# EAGLE design counter-defender-esp8266-attiny85-pir-mk-1.0 (EAGLE 7.5.0)
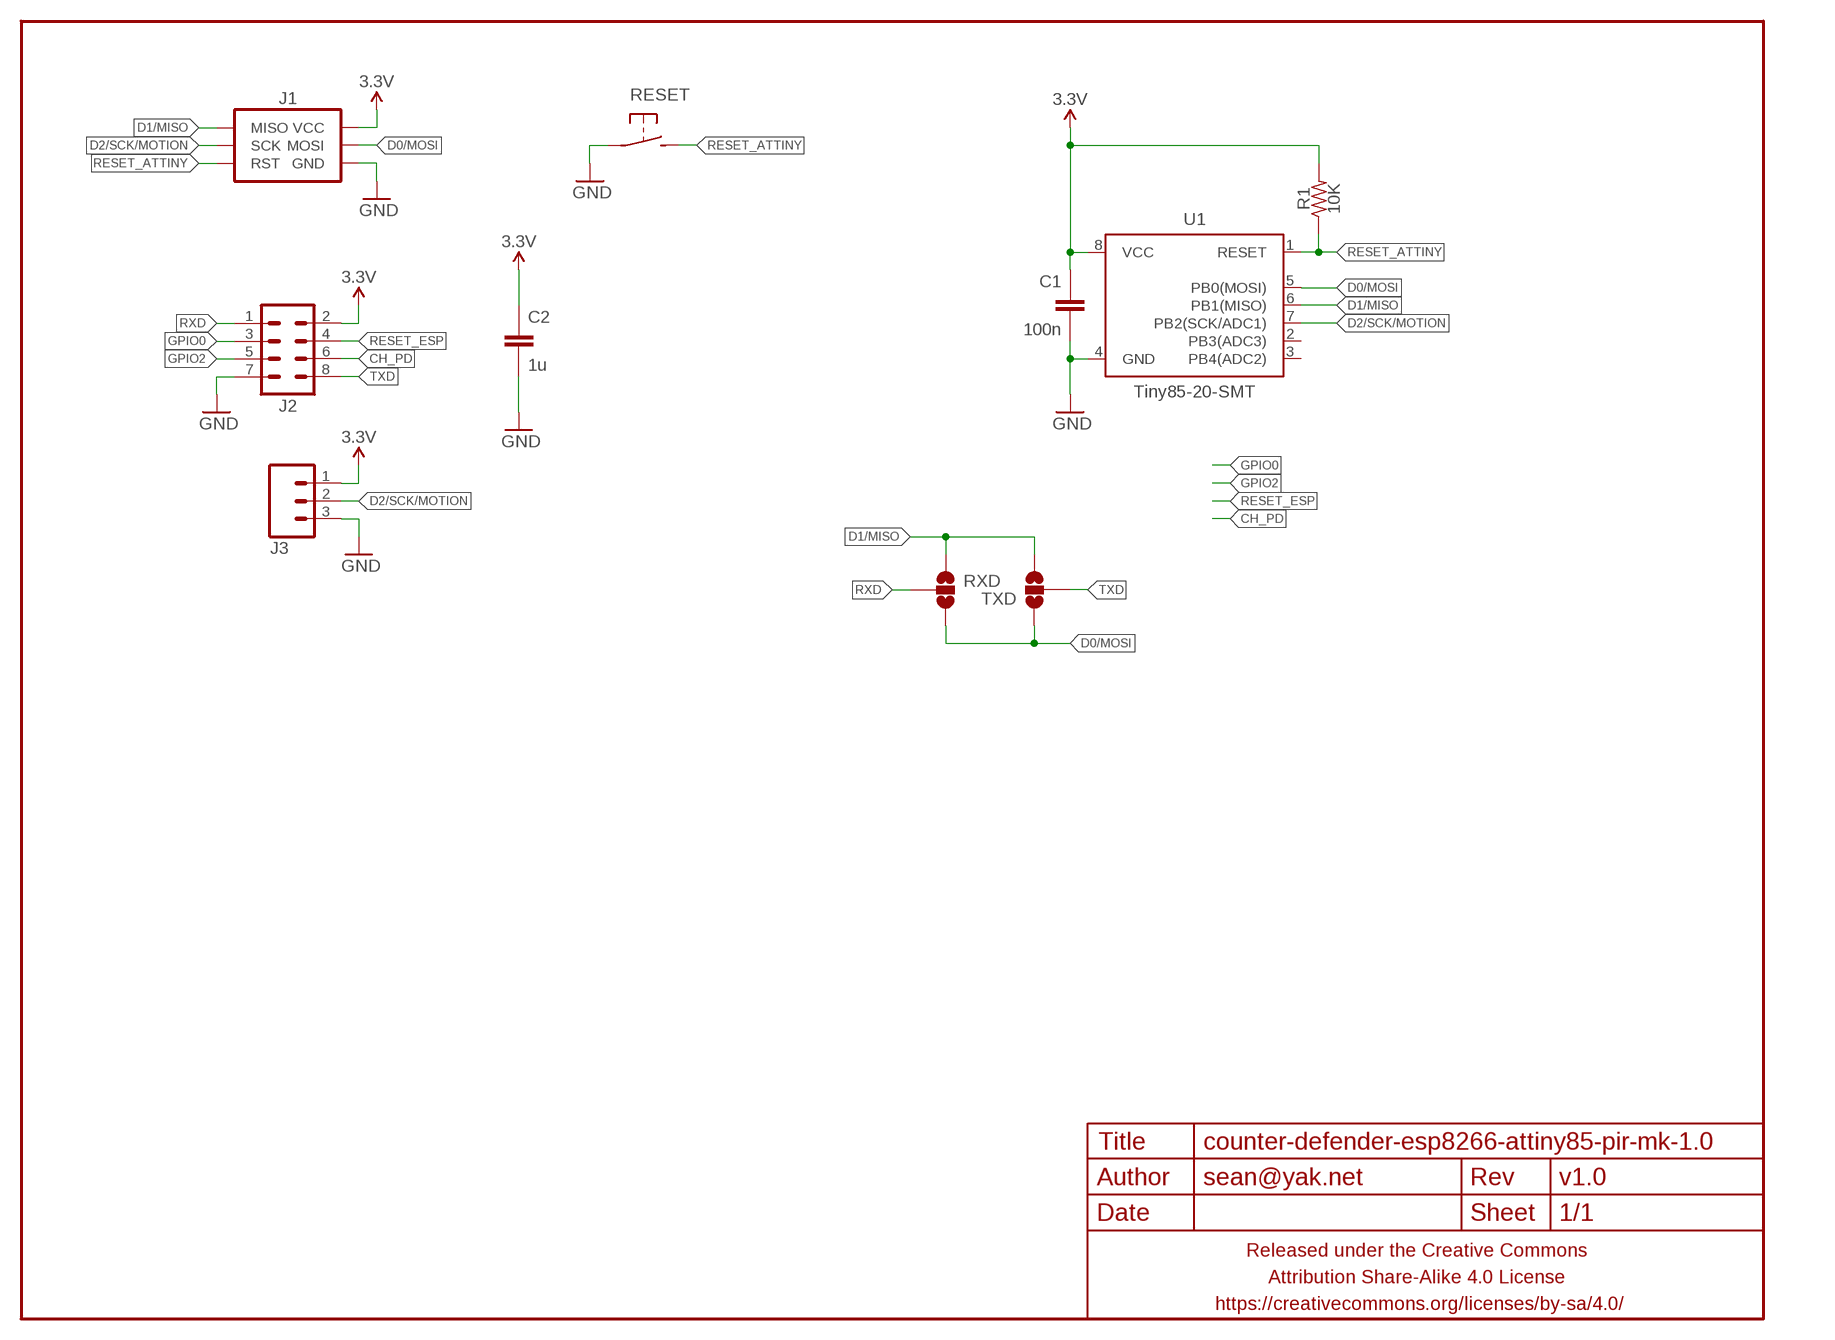
[diagram p0: schematic, sheet 1]

## Parts
C1  100n  CAPACITOR-CERAMICC0603-TIGHTER  [C0603-TIGHTER]
C2  1u  CAPACITOR-CERAMICC0603-TIGHTER  [C0603-TIGHTER]
FRAME1  FRAME-LETTERNO_PACKAGE  [DUMMY]
J1  AVR_SPI_PRG_6PTH  [2X3]
J2  M04X2PTH  [2X4_PTH]
J3  M03PTH-CENTERED  [1X03-CENTERED]
R1  10K  RESISTORR0603-TIGHTER  [R0603-TIGHTER]
RESET  SPST-NO-TACTSMD-TINIER  [TACTILE_SWITCH_SMD_TINY]
RXD  JUMPER-PAD-3-NOSMALLER  [PAD-JUMPER-3-NO_YES_SILK_FULL_BOX_SMALLER]
TXD  JUMPER-PAD-3-NOSMALLER  [PAD-JUMPER-3-NO_YES_SILK_FULL_BOX_SMALLER]
U1  Tiny85-20-SMT  ATTINY45TINY85-20-SOICW  [SO08-EIAJ]

## Nets
3.3V: C1.1 C2.1 J1.2(VCC) J2.2 J3.1 R1.2 U1.8(VCC)
CH_PD: J2.6
D0/MOSI: J1.4(MOSI) RXD.3 TXD.1 U1.5(PB0(MOSI))
D1/MISO: J1.1(MISO) RXD.1 TXD.3 U1.6(PB1(MISO))
D2/SCK/MOTION: J1.3(SCK) J3.2 U1.7(PB2(SCK/ADC1))
GND: C1.2 C2.2 J1.6(GND) J2.7 J3.3 RESET.P$1 U1.4(GND)
GPIO0: J2.3
GPIO2: J2.5
RESET_ATTINY: J1.5(RST) R1.1 RESET.P$2 U1.1(RESET)
RESET_ESP: J2.4
RXD: J2.1
TXD: J2.8 TXD.2
Unconnected: RXD.2 U1.2(PB3(ADC3)) U1.3(PB4(ADC2))

## Library data of the parts
C1 C2 = a_parts:CAPACITOR-CERAMIC: CAPACITOR, European symbol
FRAME1 = a_parts:FRAME-LETTER: Schematic Frame Standard 8.5x11 US Letter frame; DESIGNER: sean@yak.net; VERSION: v1.0
J1 = a_parts:AVR_SPI_PRG_6: AVR ISP 6 Pin This is the reduced ISP connector for AVR programming. Common on Arduino. This footprint will take up less PCB space and can be used with a 10-pin to 6-pin adapter such as SKU: BOB-08508 **Special note about "TEST_POINT" package. The stop mask is on the top side, so if you want your programming test points to be on the bottom of your board, make sure to place this package on the bottom side of the board. This also ensure that the orientation to program from the bottom side will be correct.
J2 = a_parts:M04X2
J3 = a_parts:M03: Header 3 Standard 3-pin 0.1" header. Use with straight break away headers (SKU : PRT-00116), right angle break away headers (PRT-00553), swiss pins (PRT-00743), machine pins (PRT-00117), and female headers (PRT-00115). Molex polarized connector foot print use with SKU : PRT-08232 with associated crimp pins and housings.
R1 = a_parts:RESISTOR: RESISTOR, American symbol
RESET = a_parts:SPST-NO-TACT
RXD TXD = a_parts:JUMPER-PAD-3-NO
U1 = a_parts:ATTINY45: Atmel 8-pin 2/4/8kB flash uC; PROD_ID: IC-09092

## Board
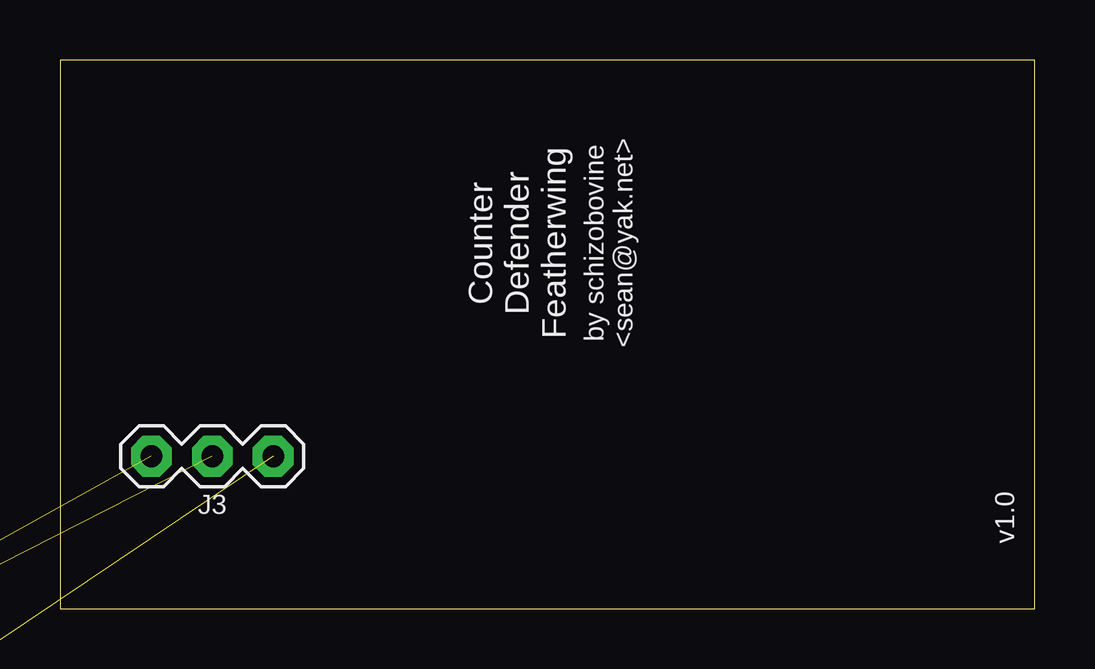
[diagram p1: board, top side]
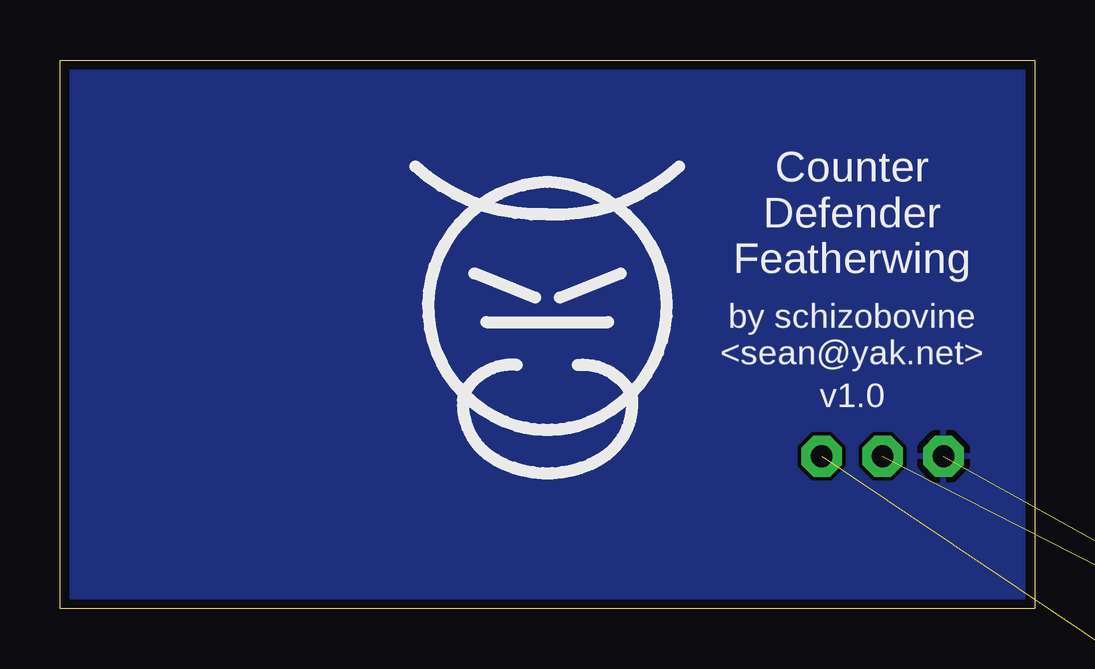
[diagram p2: board, bottom side, seen from below]

Size 40.64 x 22.86 mm. Coordinates in mm from the lower left corner, seen from the top.
Outline: 0,0 40.64,0 40.64,22.86 0,22.86 0,0
Copper layers (1*16): Top 0.0356mm / dielectric 1.5011mm / Bottom 0.0356mm
Design rules "LaenPCBOrder2": minimum track width 6mil, minimum drill 13mil, track to track 6mil, track to pad 6mil, pad to pad 6mil, via to via 6mil, smd to smd 6mil, copper to edge 15mil, drill to drill 6mil, minimum pad ring 7mil, minimum via ring 7mil, stop-mask expansion 3mil, vias tented up to drill 20mil, thermal gap 10mil

### Footprints (pad centres in the part's own frame; a part is rotated, then mirrored left to right if it is on the bottom)
C0603-TIGHTER = smd 0.8 x 1.1: 1 -0.75,0; 2 0.75,0
2X3 = drill 1 pad 1.676 octagon: 1 -2.54,-1.27; 2 -2.54,1.27; 3 0,-1.27; 4 0,1.27; 5 2.54,-1.27; 6 2.54,1.27
2X4_PTH = drill 1 pad 1.778 octagon: 1 -3.81,-1.27; 2 -3.81,1.27; 3 -1.27,-1.27; 4 -1.27,1.27; 5 1.27,-1.27; 6 1.27,1.27; 7 3.81,-1.27; 8 3.81,1.27
1X03-CENTERED = drill 0.9 pad 1.7 octagon: 1 -2.54,0; 2 0,0; 3 2.54,0
R0603-TIGHTER = smd 0.8 x 1.1: 1 -0.75,0; 2 0.75,0
TACTILE_SWITCH_SMD_TINY = smd 1.27 x 1.5: P$1 -2.5,0; P$2 2.5,0
PAD-JUMPER-3-NO_YES_SILK_FULL_BOX_SMALLER = smd 0.635 x 1.27: 1 -0.9,0; 2 0,0; 3 0.9,0
SO08-EIAJ = smd 0.61 x 1.905: 1 -1.905,-3.175; 2 -0.635,-3.175; 3 0.635,-3.175; 4 1.905,-3.175; 5 1.905,3.175; 6 0.635,3.175; 7 -0.635,3.175; 8 -1.905,3.175

### Placement (x,y rotation side)
C1  -38.1,-25.72 0 top  (outside the outline)
C2  -44.77,-42.23 0 top  (outside the outline)
FRAME1  0,0 0 top
J1  -42.86,-30.16 0 top  (outside the outline)
J2  -41.91,-37.15 0 top  (outside the outline)
J3  6.35,6.35 180 top
R1  -44.77,-45.4 0 top  (outside the outline)
RESET  -37.15,-17.78 0 top  (outside the outline)
RXD  -45.4,-55.88 0 top  (outside the outline)
TXD  -45.4,-59.37 0 top  (outside the outline)
U1  -43.5,-22.54 0 top  (outside the outline)
U$1  [COW]  20.32,11.43 0 bottom

### Tracks (layer width: path | path; a pad name or v marks a point on that pad's centre or on a via)
3.3V  (6 unrouted)
D0/MOSI  (3 unrouted)
D1/MISO  (3 unrouted)
D2/SCK/MOTION  (2 unrouted)
GND  (6 unrouted)
  pour Bottom (rank 6): 40.64,0 40.64,22.86 0,22.86 0,0
RESET_ATTINY  (3 unrouted)
TXD  (1 unrouted)

### Text on the board
tPlace: Counter / Defender / Featherwing | by schizobovine / <sean@yak.net>
bPlace: Counter / Defender / Featherwing | by schizobovine / <sean@yak.net>